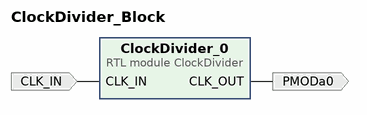
[diagram p0: block diagram of the top level]
# Vivado block design ClockDivider_Block, xc7z020clg484-1, Vivado 2024.1
create_bd_design ClockDivider_Block

create_bd_port -dir I CLK_IN
create_bd_port -dir O PMODa0

create_bd_cell -type module -reference ClockDivider ClockDivider_0
set_property -dict {CONFIG.DIVISOR 0x7735940} [get_bd_cells ClockDivider_0]

# ---- connections ----

connect_bd_net [get_bd_ports CLK_IN] [get_bd_pins ClockDivider_0/CLK_IN]
connect_bd_net [get_bd_pins ClockDivider_0/CLK_OUT] [get_bd_ports PMODa0]

validate_bd_design
save_bd_design
